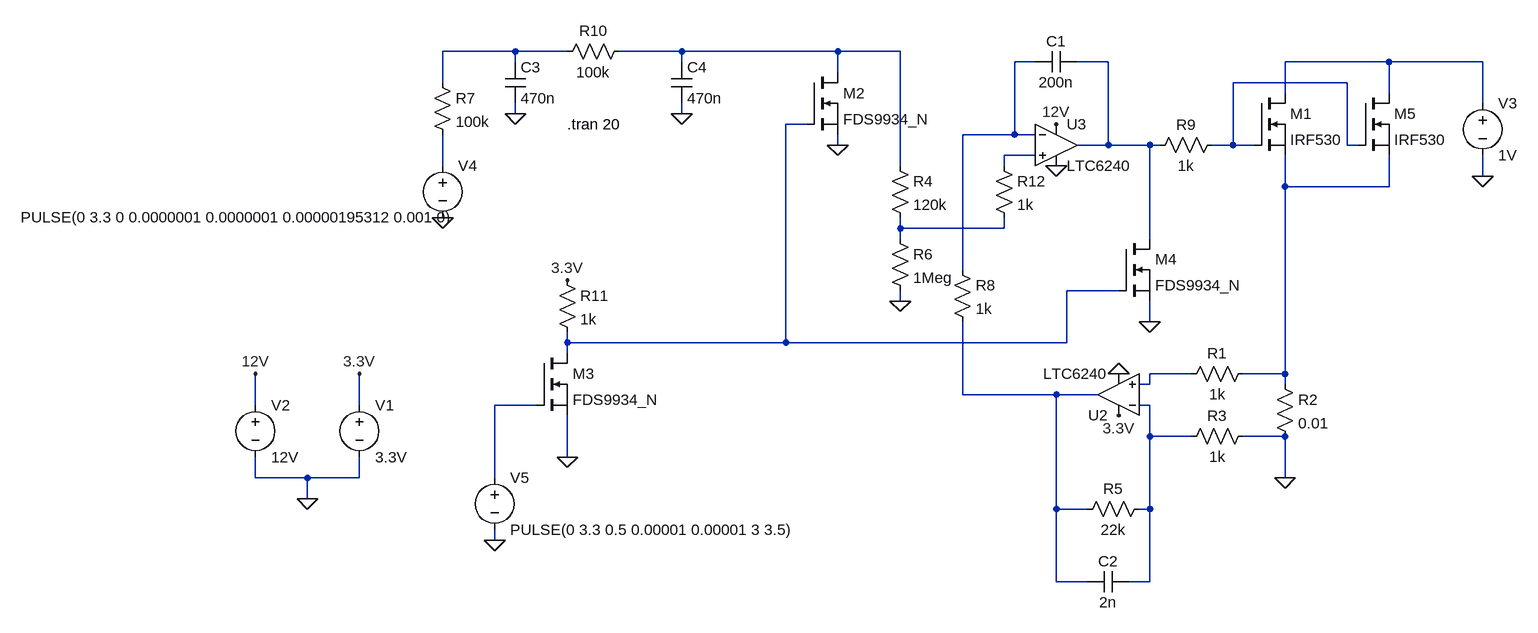
[diagram p0: schematic simulation.asc]
simulation.asc, the LTspice schematic file:
Version 4
SHEET 1 2008 720
WIRE 192 -144 80 -144
WIRE 272 -144 192 -144
WIRE 448 -144 352 -144
WIRE 688 -144 448 -144
WIRE 784 -144 688 -144
WIRE 192 -128 192 -144
WIRE 448 -128 448 -144
WIRE 992 -128 960 -128
WIRE 1104 -128 1056 -128
WIRE 1536 -128 1376 -128
WIRE 1680 -128 1536 -128
WIRE 688 -112 688 -144
WIRE 80 -96 80 -144
WIRE 1472 -96 1296 -96
WIRE 1376 -80 1376 -128
WIRE 1536 -80 1536 -128
WIRE 1680 -64 1680 -128
WIRE 192 -48 192 -64
WIRE 448 -48 448 -64
WIRE 640 -32 608 -32
WIRE 960 -16 960 -128
WIRE 960 -16 880 -16
WIRE 992 -16 960 -16
WIRE 688 0 688 -16
WIRE 1104 0 1104 -128
WIRE 1104 0 1056 0
WIRE 1168 0 1104 0
WIRE 1184 0 1168 0
WIRE 1296 0 1296 -96
WIRE 1296 0 1264 0
WIRE 1328 0 1296 0
WIRE 1472 0 1472 -96
WIRE 1488 0 1472 0
WIRE 992 16 944 16
WIRE 80 32 80 -16
WIRE 784 32 784 -144
WIRE 944 32 944 16
WIRE 1680 48 1680 16
WIRE 1376 64 1376 16
WIRE 1536 64 1536 16
WIRE 1536 64 1376 64
WIRE 784 128 784 112
WIRE 944 128 944 112
WIRE 944 128 784 128
WIRE 784 144 784 128
WIRE 1168 144 1168 0
WIRE 880 192 880 -16
WIRE 1120 224 1040 224
WIRE 784 240 784 224
WIRE 1168 272 1168 240
WIRE 272 304 272 288
WIRE 608 304 608 -32
WIRE 608 304 272 304
WIRE 1040 304 1040 224
WIRE 1040 304 608 304
WIRE 272 320 272 304
WIRE 1232 352 1168 352
WIRE 1376 352 1376 64
WIRE 1376 352 1312 352
WIRE 1168 368 1168 352
WIRE 1168 368 1152 368
WIRE 1376 368 1376 352
WIRE 880 384 880 272
WIRE 1024 384 880 384
WIRE 1088 384 1024 384
WIRE -208 400 -208 352
WIRE -48 400 -48 352
WIRE 224 400 160 400
WIRE 1168 400 1152 400
WIRE 1168 448 1168 400
WIRE 1232 448 1168 448
WIRE 1376 448 1312 448
WIRE 272 480 272 416
WIRE -208 512 -208 480
WIRE -128 512 -208 512
WIRE -48 512 -48 480
WIRE -48 512 -128 512
WIRE 160 512 160 400
WIRE 1376 512 1376 448
WIRE -128 544 -128 512
WIRE 1024 560 1024 384
WIRE 1072 560 1024 560
WIRE 1168 560 1168 448
WIRE 1168 560 1152 560
WIRE 160 608 160 592
WIRE 1024 672 1024 560
WIRE 1072 672 1024 672
WIRE 1168 672 1168 560
WIRE 1168 672 1136 672
FLAG -128 544 0
FLAG -48 352 3.3V
FLAG -208 352 12V
FLAG 80 112 0
FLAG 1120 352 0
FLAG 1376 512 0
FLAG 1024 32 0
FLAG 1024 -32 12V
FLAG 1680 48 0
FLAG 1120 416 3.3V
FLAG 784 240 0
FLAG 192 -48 0
FLAG 448 -48 0
FLAG 688 0 0
FLAG 160 608 0
FLAG 272 480 0
FLAG 272 208 3.3V
FLAG 1168 272 0
SYMBOL voltage -48 384 R0
WINDOW 123 0 0 Left 0
WINDOW 39 0 0 Left 0
SYMATTR InstName V1
SYMATTR Value 3.3V
SYMBOL voltage -208 384 R0
SYMATTR InstName V2
SYMATTR Value 12V
SYMBOL res 1360 352 R0
SYMATTR InstName R2
SYMATTR Value 0.01
SYMBOL voltage 80 16 R0
WINDOW 123 0 0 Left 0
WINDOW 39 0 0 Left 0
WINDOW 3 -649 95 Left 2
SYMATTR InstName V4
SYMATTR Value PULSE(0 3.3 0 0.0000001 0.0000001 0.00000195312 0.001 0)
SYMBOL res 1328 336 R90
WINDOW 0 0 56 VBottom 2
WINDOW 3 32 56 VTop 2
SYMATTR InstName R1
SYMATTR Value 1k
SYMBOL res 1328 432 R90
WINDOW 0 0 56 VBottom 2
WINDOW 3 32 56 VTop 2
SYMATTR InstName R3
SYMATTR Value 1k
SYMBOL res 1168 544 R90
WINDOW 0 0 56 VBottom 2
WINDOW 3 32 56 VTop 2
SYMATTR InstName R5
SYMATTR Value 22k
SYMBOL Opamps\\LTC6240 1120 384 R180
SYMATTR InstName U2
SYMBOL voltage 1680 -80 R0
WINDOW 123 0 0 Left 0
WINDOW 39 0 0 Left 0
SYMATTR InstName V3
SYMATTR Value 1V
SYMBOL nmos 1328 -80 R0
SYMATTR InstName M1
SYMATTR Value IRF530
SYMBOL Opamps\\LTC6240 1024 0 R0
SYMATTR InstName U3
SYMBOL res 768 16 R0
SYMATTR InstName R4
SYMATTR Value 120k
SYMBOL res 768 128 R0
SYMATTR InstName R6
SYMATTR Value 1Meg
SYMBOL res 64 -112 R0
SYMATTR InstName R7
SYMATTR Value 100k
SYMBOL cap 176 -128 R0
SYMATTR InstName C3
SYMATTR Value 470n
SYMBOL cap 432 -128 R0
SYMATTR InstName C4
SYMATTR Value 470n
SYMBOL res 368 -160 R90
WINDOW 0 0 56 VBottom 2
WINDOW 3 32 56 VTop 2
SYMATTR InstName R10
SYMATTR Value 100k
SYMBOL res 1280 -16 R90
WINDOW 0 0 56 VBottom 2
WINDOW 3 32 56 VTop 2
SYMATTR InstName R9
SYMATTR Value 1k
SYMBOL res 864 176 R0
SYMATTR InstName R8
SYMATTR Value 1k
SYMBOL voltage 160 496 R0
WINDOW 123 0 0 Left 0
WINDOW 39 0 0 Left 0
SYMATTR InstName V5
SYMATTR Value PULSE(0 3.3 0.5 0.00001 0.00001 3 3.5)
SYMBOL nmos 640 -112 R0
SYMATTR InstName M2
SYMATTR Value FDS9934_N
SYMBOL res 256 192 R0
SYMATTR InstName R11
SYMATTR Value 1k
SYMBOL nmos 224 320 R0
SYMATTR InstName M3
SYMATTR Value FDS9934_N
SYMBOL nmos 1120 144 R0
SYMATTR InstName M4
SYMATTR Value FDS9934_N
SYMBOL res 928 16 R0
SYMATTR InstName R12
SYMATTR Value 1k
SYMBOL cap 1056 -144 R90
WINDOW 0 0 32 VBottom 2
WINDOW 3 32 32 VTop 2
SYMATTR InstName C1
SYMATTR Value 200n
SYMBOL nmos 1488 -80 R0
SYMATTR InstName M5
SYMATTR Value IRF530
SYMBOL cap 1136 656 R90
WINDOW 0 0 32 VBottom 2
WINDOW 3 32 32 VTop 2
SYMATTR InstName C2
SYMATTR Value 2n
TEXT 272 -32 Left 2 !.tran 20

The netlist it stands for:
* simulation.asc
V1 3.3V 0 3.3V
V2 12V 0 12V
R2 N010 0 0.01
V4 N009 0 PULSE(0 3.3 0 0.0000001 0.0000001 0.00000195312 0.001 0)
R1 N010 N012 1k
R3 0 N015 1k
R5 N015 N013 22k
* U2: LTC6240 (symbol Opamps\LTC6240 not available, pins judged from their places): In+=N012 In-=N015 V+=3.3V V-=0 OUT=N013
V3 N005 0 1V
M1 N005 N006 N010 N010 IRF530
* U3: LTC6240 (symbol Opamps\LTC6240 not available, pins judged from their places): In+=N008 In-=N003 V+=12V V-=0 OUT=N004
R4 N002 N011 120k
R6 N011 0 1Meg
R7 N001 N009 100k
C3 N001 0 470n
C4 N002 0 470n
R10 N002 N001 100k
R9 N006 N004 1k
R8 N003 N013 1k
V5 N014 0 PULSE(0 3.3 0.5 0.00001 0.00001 3 3.5)
M2 N002 N007 0 0 FDS9934_N
R11 3.3V N007 1k
M3 N007 N014 0 0 FDS9934_N
M4 N004 N007 0 0 FDS9934_N
R12 N008 N011 1k
C1 N004 N003 200n
M5 N005 N006 N010 N010 IRF530
C2 N015 N013 2n
.model NMOS NMOS
.model PMOS PMOS
.lib standard.mos
.tran 20
.backanno
.end